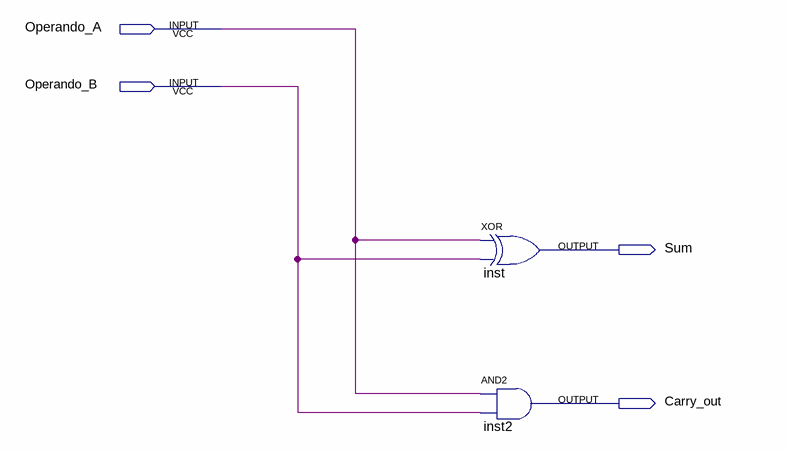
[diagram p0: schematic sheet]
// Quartus schematic Half_Adder.bdf as structural Verilog: 2 symbols, 4 pins
module Half_Adder (
  input  Operando_A,
  input  Operando_B,
  output Sum,
  output Carry_out
);

  xor inst (Sum, Operando_A, Operando_B);
  and inst2 (Carry_out, Operando_A, Operando_B);
endmodule
